# Altium project DC_CDI_Honda_CX500_rev1.3.PrjPcb
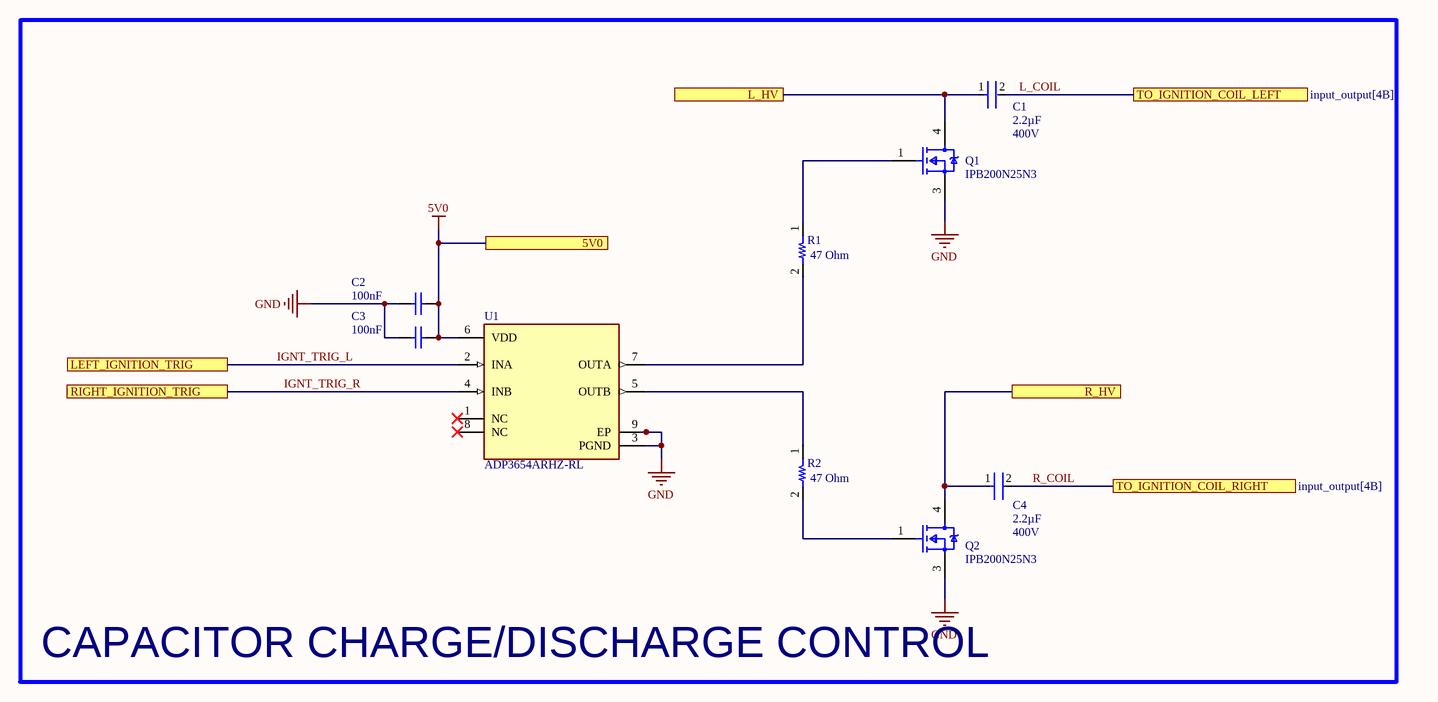
[diagram p0: cd_switching.SchDoc]
6 sheets, 132 parts. Net scope: flat (ports and power ports of the same name join across sheets).
Board file: dc_cdi_cx500.PcbDoc
Sheets:
  cd_switching.SchDoc
  input_output.SchDoc
  input_signal_conditioning.SchDoc
  logic.SchDoc
  HV_power.SchDoc
  LV_power.SchDoc

## Sheet cd_switching.SchDoc: Power Side
size A3; SheetNumber: 1; SheetTotal: 6

### Parts
C1  Voltage Rating (AC): 400V  Capacitance: 2.2µF  [FP-BFC233820225-MFG]  (hidden comment: BFC233820225)
C2  value 100nF  [CAPC1608X90X35LL15T15]  (hidden comment: 06035C104KAT4A)
C3  value 100nF  [CAPC1608X87X35NL15T15]  (hidden comment: C0603C475K8PACTU)
C4  Voltage Rating (AC): 400V  Capacitance: 2.2µF  [FP-BFC233820225-MFG]  (hidden comment: BFC233820225)
Q1  IPB200N25N3  [FP-PG-TO252-3-MFG]
Q2  IPB200N25N3  [FP-PG-TO252-3-MFG]
R1  value 47 Ohm  [0603_FP]  (hidden comment: Resistor_0603)
R2  value 47 Ohm  [0603_FP]  (hidden comment: Resistor_0603)
U1  ADP3654ARHZ-RL  [FP-RH-8-1-IPC_C]

### Blocks framed on the sheet
CAPACITOR CHARGE/DISCHARGE CONTROL: C1-C4 Q1 Q2 R1 R2 U1

### Ports
5V0 (see LV_power[3B]), L_HV (see HV_power[4A]), LEFT_IGNITION_TRIG (see logic[1A]), R_HV (see HV_power[4B]), RIGHT_IGNITION_TRIG (see logic[1B]), TO_IGNITION_COIL_LEFT (see input_output[4B]), TO_IGNITION_COIL_RIGHT (see input_output[4B])

### Nets
5V0: C2.1 C3.2 U1.6(VDD) ; port 5V0
GND: C2.2 C3.1 Q1.3(SOURCE) Q2.3(SOURCE) U1.3(PGND) U1.9(EP)
IGNT_TRIG_L: U1.2(INA) ; port LEFT_IGNITION_TRIG
IGNT_TRIG_R: U1.4(INB) ; port RIGHT_IGNITION_TRIG
L_COIL: C1.2 ; port TO_IGNITION_COIL_LEFT
L_HV: C1.1 Q1.4(DRAIN) ; port L_HV
R_COIL: C4.2 ; port TO_IGNITION_COIL_RIGHT
R_HV: C4.1 Q2.4(DRAIN) ; port R_HV
NetQ1_1: Q1.1(GATE) R1.1
NetQ2_1: Q2.1(GATE) R2.2
NetR1_2: R1.2 U1.7(OUTA)
NetR2_1: R2.1 U1.5(OUTB)

Not connected (* = marked no-connect by the designer): U1 1(NC)* 8(NC)*

### Library data of the parts
C1 C4 = CMP-00030-39758189-1: BFC233820225 Film Capacitor, Polypropylene, 800V, 20% +Tol, 20% -Tol, 0.22uF, Through Hole Mount; Insulation Resistance: 11GΩ; Lead Diameter: 800µm; Voltage Rating (DC): 630V; Dielectric: PP; Packaging: Bulk; Lead Pitch: 27.5mm; Number of Pins: 2; Contact Plating: Tin; Height - Seated (Max): 24.9936mm; Width: 15.0114mm; Min Operating Temperature: -55°C; Lead Free: Lead Free; Length: 31.5mm; Schedule B: 8532250020, 8532250020; Depth: 15mm; NexarPartId: 39758189; Max Operating Temperature: 110°C; Tolerance: 20%; Dielectric Material: PP; RoHS: Compliant; Height: 28mm; Case/Package: Radial; Diameter: 18mm; Termination: Radial; Voltage Rating: 630V; REACH SVHC: Unknown; Radiation Hardening: No; Mount: Through Hole
C2 = CMP-2006-04390-1: Manufacturer: AVX Interconnect / Elco; Part Number: 06035C104KAT4A
C3 = CMP-2006-03238-1: Manufacturer: Kemet; Part Number: C0603C475K8PACTU
Q1 Q2 = CMP-32901-000143-1: MOSFET N-CH 30V 161A DPAK; Manufacturer Part Number: IRLR7843TRPBF; Manufacturer: Infineon; Drain To Source Resistance: 3.2mΩ; Depletion Mode: False; Reverse Recovery Time: 39ns; Reverse Recovery Charge: 36nC; Threshold Vgs Max: 2.3V; Rthja Max: 50°C/W; Threshold Vgs Min: 1.4V; Power Dissipation: 140W; Pulse Drain Current: 620A; Input Capacitace At Vds: 4380pF @ 15V; Turn On Delay Time: 25ns; Gate To Source Voltage: 20V; Max Forward Diode Voltage: 1V; Gate Charge At Vgs: 34nC @ 4.5V; Max Junction Temp: +175°C; Number Of Channels: 1; Turn Off Delay Time: 34ns; ComponentLink2URL: https://www.infineon.com/dgdl/irlr7843pbf.pdf?fileId=5546d462533600a40153566de53526d8; Temperature Range High: +175°C; Octopart: https://octopart.com/irlr7843trpbf-infineon-65875062; Temperature: -55°C to +175°C; Device Class L3: MOSFETs; Category: Trans; Package: PG-TO252-3; Footprint Url: https://www.infineon.com/cms/en/product/packages/PG-TO252/PG-TO252-3-901/; Continuous Drain Current: 161A; Digikey Description: MOSFET N-CH 30V 161A DPAK; Automotive: No; Lead Free: Yes; Drain To Source Breakdown Voltage: 30V; Height: 2.52mm; Temperature Range Low: -55°C; RoHS: TRUE; Number Of N Channels: 1; Drain To Source Voltage: 30V; ComponentLink2Description: Datasheet; Device Class L2: Transistors; Device Class L1: Discrete Semiconductors
R1 R2 = Resistor_0603: Format: 0402; Package: 0402
U1 = CMP-09133-000023-1: IC GATE DRVR LOW-SIDE 8MINISOIC; Number of Outputs: 2; Min Supply Voltage: 4.5V; Output Current: 4A; Max Supply Current: 3mA; Rise Time: 14ns; Fall Time: 25ns; Max Supply Voltage: 18V; Turn-On Delay Time: 35ns; Channel Type: Independent; Package Quantity: 3000; RoHS Compliant: Yes; Series: -; Max Operating Temperature: 125°C; Mount: Surface Mount; Max Output Current: 4A; Lead Free: Contains Lead; Supply Current: 3mA; Packaging: Tape and Reel; Case/Package: MSOP; Min Operating Temperature: -40°C; Min Input Voltage: 4.5V; Max Input Voltage: 18V; Number of Drivers: 2; Nominal Supply Current: 3mA; Number of Pins: 8; Propagation Delay: 35ns

## Sheet input_output.SchDoc
size A4; SheetNumber: 2; SheetTotal: 6
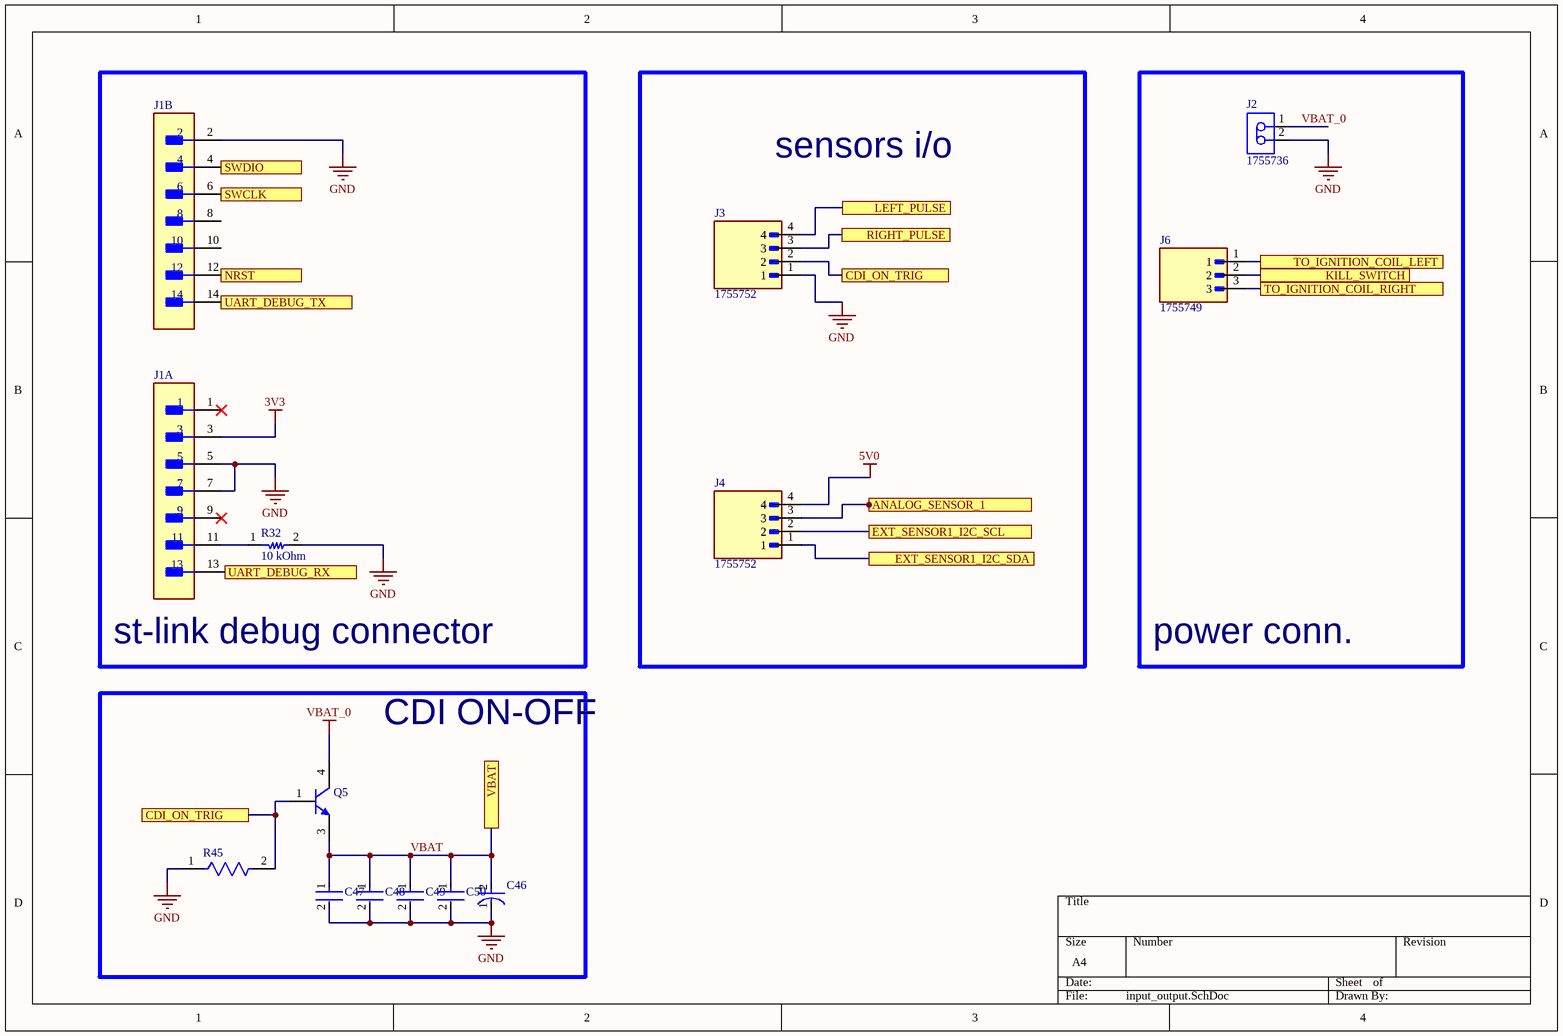
[diagram p1: input_output.SchDoc]

### Parts
C46  EEEFT1E471AP  [FP-FTF-MFG]  (value not drawn)
C47  C1206X104J3GACTU  [FP-C1206X104J3GACTU-MFG]  (value not drawn)
C48  C1206X104J3GACTU  [FP-C1206X104J3GACTU-MFG]  (value not drawn)
C49  C1206X104J3GACTU  [FP-C1206X104J3GACTU-MFG]  (value not drawn)
C50  C1206X104J3GACTU  [FP-C1206X104J3GACTU-MFG]  (value not drawn)
J1  FTSH-107-01-F-DV-K  [FP-FTSH-107-01-F-DV-K-MFG]  (value not drawn)  (parts A,B of 2)
J2  1755736  [PHOE-1755736-2_V]
J3  1755752  [PHOENIX_1755752]
J4  1755752  [PHOENIX_1755752]
J6  1755749  [PHOENIX_1755749]
Q5  MJD3055T4G  [ONSC-DPAK-3-369C-01_V]  (value not drawn)
R32  value 10 kOhm  [0603_FP]  (hidden comment: Resistor_0603)
R45  CRGP0805F10K  [FP-CRGP0805-IPC_C]  (value not drawn)

### Blocks framed on the sheet
st-link debug connector: J1 R32
sensors i/o: J3 J4
power conn.: J2 J6
CDI ON-OFF: C46-C50 Q5 R45

### Ports
ANALOG_SENSOR_1 (see logic[1A]), CDI_ON_TRIG (see input_output[1D]), CDI_ON_TRIG (see input_output[3B]), EXT_SENSOR1_I2C_SCL (see logic[3A]), EXT_SENSOR1_I2C_SDA (see logic[3A]), KILL_SWITCH (see logic[3B]), LEFT_PULSE (see input_signal_conditioning[1B]), NRST (see logic[3B]), RIGHT_PULSE (see input_signal_conditioning[1C]), SWCLK (see logic[1B]), SWDIO (see logic[1B]), TO_IGNITION_COIL_LEFT (see cd_switching[6B]), TO_IGNITION_COIL_RIGHT (see cd_switching[6C]), UART_DEBUG_RX (see logic[1B]), UART_DEBUG_TX (see logic[1B]), VBAT (see HV_power[1C], LV_power[1B])

### Nets
3V3: J1.3
5V0: J4.4
GND: C46.1(C) C47.2 C48.2 C49.2 C50.2 J1.2 J1.5 J1.7 J2.2 J3.1 R32.2 R45.1
VBAT_0: J2.1 Q5.4(C)
EXT_SENSOR1_I2C_SCL: J4.2 ; port EXT_SENSOR1_I2C_SCL
EXT_SENSOR1_I2C_SDA: J4.1 ; port EXT_SENSOR1_I2C_SDA
L_COIL: J6.1 ; port TO_IGNITION_COIL_LEFT
R_COIL: J6.3 ; port TO_IGNITION_COIL_RIGHT
SWCLK: J1.6 ; port SWCLK
SWDIO: J1.4 ; port SWDIO
UART_DEBUG_RX: J1.13 ; port UART_DEBUG_RX
UART_DEBUG_TX: J1.14 ; port UART_DEBUG_TX
VBAT: C46.2(A) C47.1 C48.1 C49.1 C50.1 Q5.3(E) ; port VBAT
NetD1_1: J3.4 ; port LEFT_PULSE
NetD2_1: J3.3 ; port RIGHT_PULSE
NetJ1_11: J1.11 R32.1
NetJ1_12: J1.12 ; port NRST
NetJ3_2: J3.2 Q5.1(B) R45.2 ; port CDI_ON_TRIG
NetJ4_3: J4.3 ; port ANALOG_SENSOR_1
NetJ6_2: J6.2 ; port KILL_SWITCH

Not connected (* = marked no-connect by the designer): J1 1* 8 9* 10

### Notes on the sheet
- (in symbol CMP-05427-000040-1) +

### Library data of the parts
C46 = CMP-05427-000040-1: CAP ALUM 470UF 20% 25V SMD; ESR (Equivalent Series Resistance): 80mR; Dielectric Material: Aluminium; Lead Diameter: 0.9mm; Ripple Current: 850mA; Leakage Current: 117.5uA; Life (Hours): 2000Hour; Lead Free: Lead Free; Height - Seated (Max): 0.413inch; Contact Plating: Tin; Voltage: 25V; Package Quantity: 500; REACH SVHC: No SVHC; Diameter: 8mm; Features: General Purpose; Voltage Rating: 25V; Radiation Hardening: No; Number of Pins: 2; Length: 10.2mm; Max Operating Temperature: 105°C; Tolerance: 20%; Lead Pitch: 3.1mm; Voltage Rating (DC): 25V; Packaging: Tape and Reel; RoHS Compliant: Yes; Series: FT; Height: 10.2mm; Capacitance: 470uF; Construction: Cylindrical; Case/Package: Radial; Mount: Surface Mount; Termination: SMD/SMT; Min Operating Temperature: -55°C; Ripple Current (AC): 850mA
C47-C50 = CMP-03020-034648-1: CAP CER 0.1UF 25V C0G/NP0 1206; RoHS Compliant: Yes
J1 = CMP-02766-001448-1: CONN HEADER SMD 14POS 1.27MM; Gender: Male; Connector Type: Male Pin; Number of Contacts: 14; Row Spacing: 0.05inch; Min Operating Temperature: -55°C; Package Quantity: 1; Lead Free: Lead Free; RoHS Compliant: Yes; Contact Material: Bronze; Contact Plating: Gold; Number of Rows: 2; Housing Material: Polymer; Contact Type: Male Pin; Series: FTSH; Max Operating Temperature: 125°C; Orientation: Straight; Number of Positions: 14; Pitch: 1.27mm; Housing Color: Black; Color: Black; Radiation Hardening: No; Length: 8.89mm; Termination: Solder; Packaging: Rail/Tube; Depth: 5.84mm; Mount: Surface Mount; Contact Mating Length: 0.12inch
J2 = CMP-2000-05300-1: Male Header, Pitch 5.08 mm, 1 x 2 Postion, Height 12 mm, Tail Length 3.9 mm, RoHS, Bulk; Manufacturer: Phoenix Contact; Content: 250pc(s); Pitch: 5.08mm; Industrial packaging: Yes; Number of contacts: 2; Manufacturer URL: http://www.phoenixcontact.com/; Datasheet Version: Apr-16; Datasheet URL: http://www.mouser.com/ds/2/324/ItemDetail_1755736-921028.pdf; Manufacturer part No.: 1755736; Type: MSTBVA2,5/2-G-5,08; Colour: Green
Q5 = CMP-1048-00146-1: Complementary Power Transistor, 3-Pin DPAK, Pb-Free, Tape and Reel; Manufacturer: On Semiconductor; Polarity: NPN; fT Min (MHz): 2; IC Continuous (A): 10; PackageVersion: Rev. E, 02/2014; ComponentLink3URL: http://www.onsemi.cn/pub_link/Collateral/369C.PDF; ComponentLink1Description: Manufacturer URL; PackageReference: DPAK-3-369C-01; ComponentLink1URL: http://www.onsemi.com/; ComponentLink3Description: Package Specification; ComponentLink2URL: http://www.onsemi.cn/pub_link/Collateral/MJD2955-D.PDF; ComponentLink2Description: Datasheet; DatasheetVersion: Rev. 13; Packing: Tape and Reel; PackageDescription: 3-Pin Flange Mount, Body 6.54 x 6.095 mm, Pitch 2.29 mm; Mounting Technology: Surface Mount; PartNumber: MJD3055T4G; RoHS: TRUE
R32 = Resistor_0603: Format: 0402; Package: 0402
R45 = CMP-03211-006861-1: CRGP 0805 10K 1%; Manufacturer: TE; Power Rating: 0.33W; Voltage Rating: 150V; Value: 10KΩ; Tolerance: 0.01; Temperature Coefficient: ±100ppm/°C; Manufacturer Part Number: CRGP0805F10K; ComponentLink2URL: https://www.mouser.com/datasheet/2/418/NG_DS_9-1773463-9_A-1358566.pdf; Temperature Range Low: -55°C; Ipc Land Pattern Name: RESC200125X55; Device Class L2: Resistors; Automotive: No; Device Class L3: Chip SMD Resistors; Composition: Thick Film; Temperature Range High: +155°C; Temperature: -55°C to +155°C; Height: 0.65mm; Series: CRGP; RoHS: TRUE; Device Class L1: Passive Components; Octopart: https://octopart.com/crgp0805f10k-te+connectivity-91018782; Package: CRGP0805; Digikey Description: CRGP 0805 10K 1%; Ambient Temperature Range High: +70°C; Lead Free: Yes; ComponentLink2Description: Datasheet; Category: Res; Resistance: 10KΩ
J3 J4 = 1755752: Package: None; Price: None; Value: *; MP: 1755752; Availability: Unavailable
J6 = 1755749: Package: None; Price: None; Value: *; MP: 1755749; Availability: Unavailable

## Sheet input_signal_conditioning.SchDoc
size A4; SheetNumber: 3; SheetTotal: 6
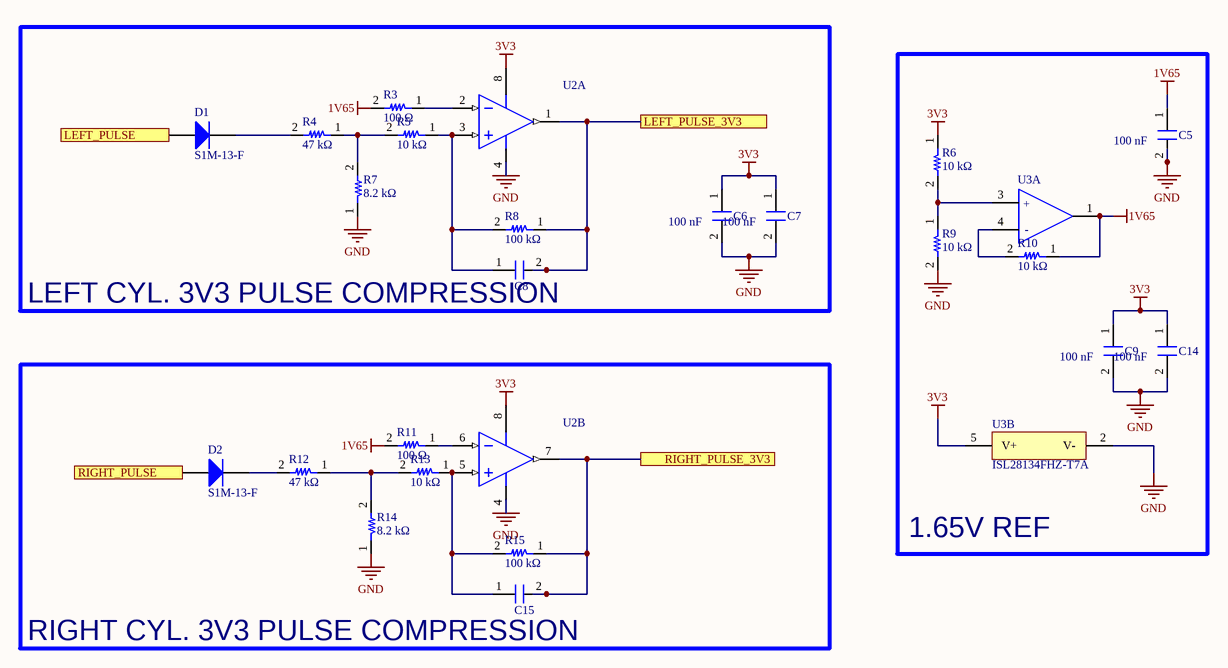
[diagram p2: input_signal_conditioning.SchDoc]

### Parts
C5  value 100 nF  [0402_fp]  (hidden comment: Capacitor_0402)
C6  value 100 nF  [0402_fp]  (hidden comment: Capacitor_0402)
C7  value 100 nF  [0402_fp]  (hidden comment: Capacitor_0402)
C8  Capacitor_0402  [0402_fp]  (value not drawn)
C9  value 100 nF  [0402_fp]  (hidden comment: Capacitor_0402)
C14  value 100 nF  [0402_fp]  (hidden comment: Capacitor_0402)
C15  Capacitor_0402  [0402_fp]  (value not drawn)
D1  S1M-13-F  [DIOD-S1M-13-F-SMA-2_V]
D2  S1M-13-F  [DIOD-S1M-13-F-SMA-2_V]
R3  value 100 Ω  [0402_fp]  (hidden comment: Resistor_0402)
R4  value 47 kΩ  [0402_fp]  (hidden comment: Resistor_0402)
R5  value 10 kΩ  [0402_fp]  (hidden comment: Resistor_0402)
R6  value 10 kΩ  [0402_fp]  (hidden comment: Resistor_0402)
R7  value 8.2 kΩ  [0402_fp]  (hidden comment: Resistor_0402)
R8  value 100 kΩ  [0402_fp]  (hidden comment: Resistor_0402)
R9  value 10 kΩ  [0402_fp]  (hidden comment: Resistor_0402)
R10  value 10 kΩ  [0402_fp]  (hidden comment: Resistor_0402)
R11  value 100 Ω  [0402_fp]  (hidden comment: Resistor_0402)
R12  value 47 kΩ  [0402_fp]  (hidden comment: Resistor_0402)
R13  value 10 kΩ  [0402_fp]  (hidden comment: Resistor_0402)
R14  value 8.2 kΩ  [0402_fp]  (hidden comment: Resistor_0402)
R15  value 100 kΩ  [0402_fp]  (hidden comment: Resistor_0402)
U2  LM358MX  [D0008A_M]  (value not drawn)  (parts A,B of 2)
U3  ISL28134FHZ-T7A  [P5_064A_MFG]  (value not drawn)  (parts A,B of 2)

### Blocks framed on the sheet
LEFT CYL. 3V3 PULSE COMPRESSION: C6-C8 D1 R3-R5 R7 R8 U2
1.65V REF: C5 C9 C14 R6 R9 R10 U3
RIGHT CYL. 3V3 PULSE COMPRESSION: C15 D2 R11-R15 U2

### Ports
LEFT_PULSE (see input_output[3A]), LEFT_PULSE_3V3 (see logic[1D], logic[3A]), RIGHT_PULSE (see input_output[3A]), RIGHT_PULSE_3V3 (see logic[1D], logic[3A])

### Nets
1V65: C5.1 R3.2 R10.1 R11.2 U3.1(OUT)
3V3: C6.1 C7.1 C9.1 C14.1 R6.1 U2.8(V+) U3.5(V+)
GND: C5.2 C6.2 C7.2 C9.2 C14.2 R7.1 R9.2 R14.1 U2.4(GND) U3.2(V-)
NetC8_1: C8.1 R5.1 R8.2 U2.3(INA+)
NetC8_2: C8.2 R8.1 U2.1(OUTA) ; port LEFT_PULSE_3V3
NetC15_1: C15.1 R13.1 R15.2 U2.5(INB+)
NetC15_2: C15.2 R15.1 U2.7(OUTB) ; port RIGHT_PULSE_3V3
NetD1_1: D1.1(A) ; port LEFT_PULSE
NetD1_2: D1.2(K) R4.2
NetD2_1: D2.1(A) ; port RIGHT_PULSE
NetD2_2: D2.2(K) R12.2
NetR3_1: R3.1 U2.2(INA-)
NetR4_1: R4.1 R5.2 R7.2
NetR6_2: R6.2 R9.1 U3.3(IN+)
NetR10_2: R10.2 U3.4(IN-)
NetR11_1: R11.1 U2.6(INB-)
NetR12_1: R12.1 R13.2 R14.2

### Notes on the sheet
- (in symbol CMP-00572-88252605-3, part A) +; -

### Library data of the parts
C5-C7 C9 C14 = Capacitor_0402: Format: 0402; Package: 0402
C8 C15 = Capacitor_0402: Value: 3.3 nF; Format: 0402; Package: 0402
D1 D2 = CMP-0639-00001-1: Surface Mount Glass Passivated Rectifier, 1000V, 1 A, -65 to 125 degC, 2-Pin SMA Package, RoHS, Tape and Reel; Manufacturer: Diodes Inc; Maximum Reverse Current IR (uA): 5; Maximum Peak Forward Surge Current IFSM (A): 30; Maximum Average Rectified Current IO (A): 1; Peak Repetitive Reverse Voltage VRRM (V): 1000; Total Capacitance CT (pF): 10; Forward Voltage Drop VF (V): 1.1; ComponentLink1URL: http://www.diodes.com/; Operating Temperature Range: -65 to 150 degC; ComponentLink3URL: http://diodes.com/datasheets/ds16003.pdf; ComponentLink3Description: Package Specification; PackageDescription: 2-Pin SMD, Body 4.3 x 2.605 mm, Height 2.3 mm; Mounting Technology: Surface Mount; ComponentLink1Description: Manufacturer URL; PackageReference: S1M-13-F-SMA-2; ComponentLink2URL: http://diodes.com/datasheets/ds16003.pdf; ComponentLink2Description: Datasheet; RoHS: TRUE; DatasheetVersion: Rev. 22 - 2; Packing: Tape and Reel; PackageVersion: Rev. 22 - 2; PartNumber: S1M-13-F
U2 = CMP-0055-00630-3: Low Power Dual Operational Amplifier, 8-pin Narrow SOIC; Manufacturer: Texas Instruments; PowerWise: N; PackageTopMarking: NSZXTT*LM*358M; CompType: Amplifiers; ComponentLink1URL: http://www.ti.com/general/docs/lit/getliterature.tsp?genericPartNumber=LM358-N&fileType=pdf; PinCount: 8; PackageDescription: SOIC Narrow, 4.9 x 3.9 x 1.45mm, 8 Lead, 1.27mm Pitch; Code_IPC: SOIC127P600-8; RoHS: N; Code_JEDEC: MS-012-AA; Package Reference: D0008A; ComponentLink1Description: Datasheet URL
U3 = CMP-00572-88252605-3: 5V Ultra Low Noise, Zero Drift Rail-to-Rail Precision Op Amp; Manufacturer Lifecycle Status: ACTIVE; Slew Rate: 1.5V/µs; Min Dual Supply Voltage: 1.125V; Bandwidth: 3.5MHz; Operating Supply Current: 675µA; Output Current per Channel: 65mA; Power Supply Rejection Ratio (PSRR): 135dB; Input Offset Voltage (Vos): -200nV; RAM Size: 384kB; Voltage Gain: 174dB; Number of Channels: 1; Pitch: 1mm; Max Supply Voltage: 6V; Input Bias Current: 120pA; Min Supply Voltage: 2.25V; Max Dual Supply Voltage: 3V; Supply Type: Dual, Single; Radiation Hardening: No; Min Operating Temperature: -40°C; ComponentLink1URL: http://www.renesas.com; ComponentLink3URL: https://www.renesas.com/en/document/psc/package-drawing-sot23-5pin-p5064a; Number of Pins: 5; Length: 2.9mm; Contact Plating: Tin; ComponentLink2URL: https://octopart.com/cad-content/api/get-model-datasheet/15189/88252605; Export Control Classification Number (ECCN) Code: EAR99; ComponentLink1Description: Manufacturer's Website; Gain Bandwidth Product: 3.5MHz; HelpURL: https://octopart.com/cad-content/api/get-model-datasheet/15189/88252605; ComponentLink3Description: Manufacturer's Package Drawing; RoHS: Compliant; Case/Package: SOT-23; Common Mode Rejection Ratio: 135dB; Lead Free: Lead Free; Output Current: 65mA; Width: 1.6mm; Nominal Supply Current: 675µA; Lifecycle Status: Production; Mount: Surface Mount; ComponentLink2Description: Datasheet URL; Max Operating Temperature: 125°C; Height: 0m; Number of Circuits: 1
R3-R15 = Resistor_0402: Package: 0402

## Sheet logic.SchDoc
size A4; SheetNumber: 4; SheetTotal: 6
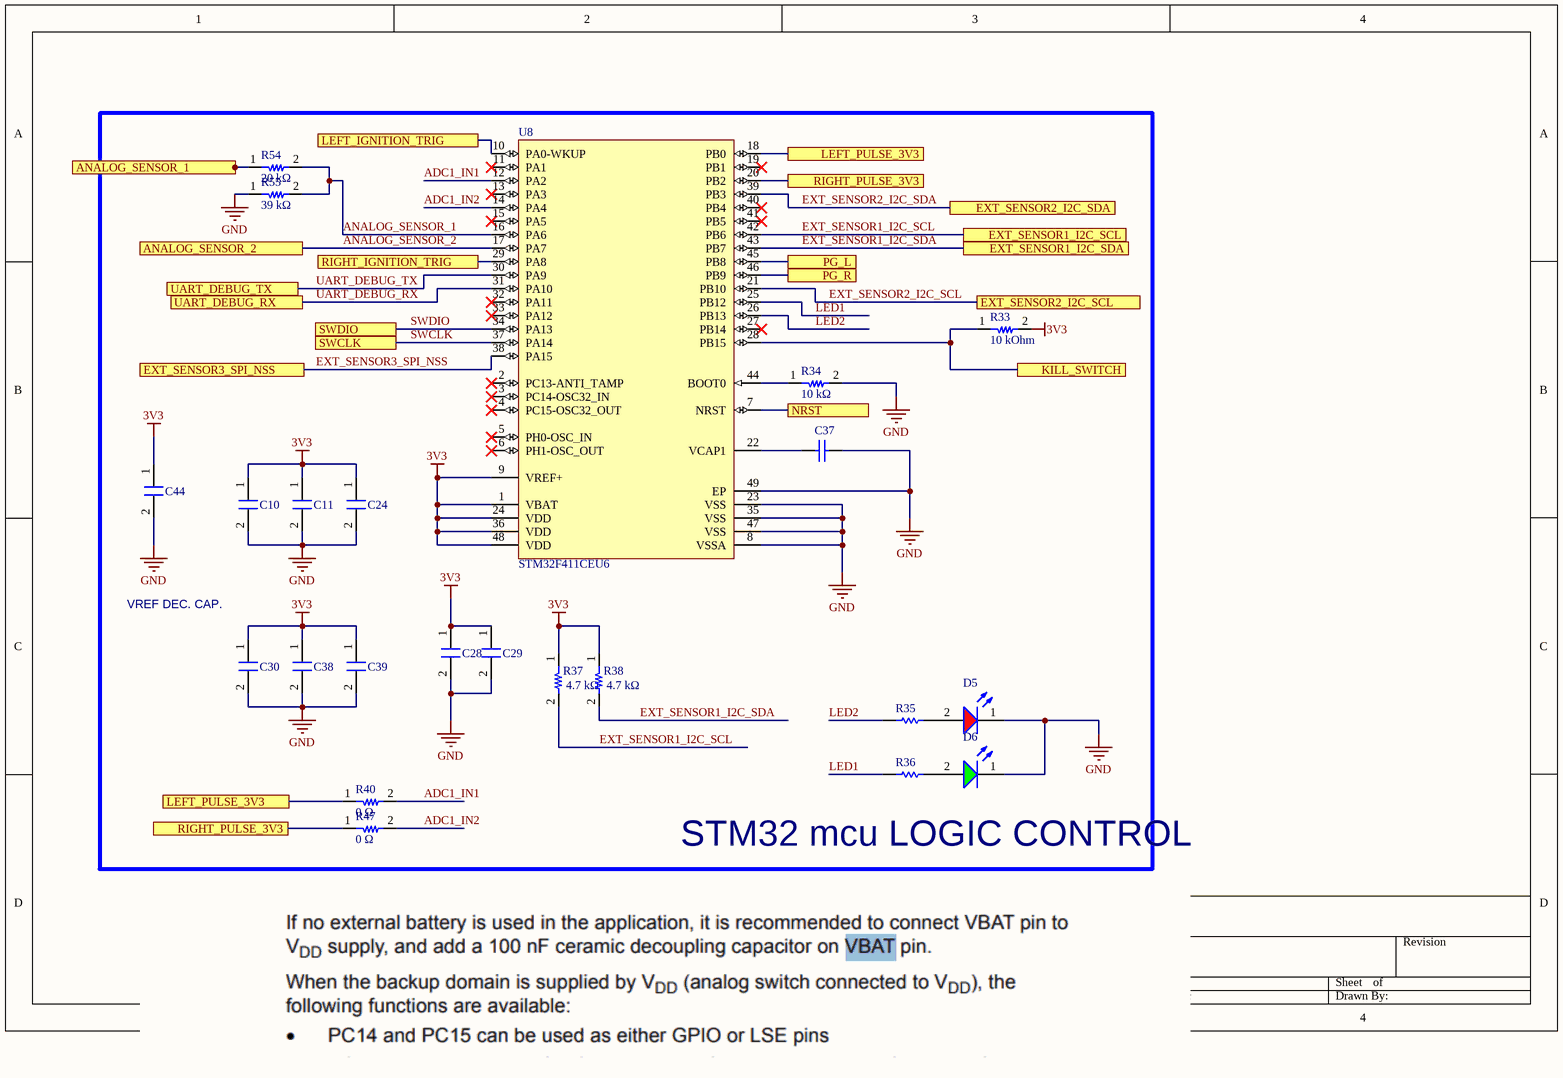
[diagram p3: logic.SchDoc]

### Parts
C10  Capacitor_0402  [0402_fp]  (value not drawn)
C11  Capacitor_0402  [0402_fp]  (value not drawn)
C24  Capacitor_0402  [0402_fp]  (value not drawn)
C28  Capacitor_0402  [0402_fp]  (value not drawn)
C29  Capacitor_0402  [0402_fp]  (value not drawn)
C30  Capacitor_0402  [0402_fp]  (value not drawn)
C37  0603ZD475MAT2A  [CAPC1608X90X35NL15T15]  (value not drawn)
C38  Capacitor_0402  [0402_fp]  (value not drawn)
C39  Capacitor_0402  [0402_fp]  (value not drawn)
C44  Capacitor_0402  [0402_fp]  (value not drawn)
D5  150080RS75000  [WL-SMCW_0805_150080xx75000]  (value not drawn)
D6  150080GS75000  [WL-SMCW_0805_150080xx75000]  (value not drawn)
R33  value 10 kOhm  [0603_FP]  (hidden comment: Resistor_0603)
R34  value 10 kΩ  [0402_fp]  (hidden comment: Resistor_0402)
R35  MCS04020D5600BE100  [RESC1005X37X20NL05T10]  (value not drawn)
R36  MCS04020D5600BE100  [RESC1005X37X20NL05T10]  (value not drawn)
R37  value 4.7 kΩ  [0402_fp]  (hidden comment: Resistor_0402)
R38  value 4.7 kΩ  [0402_fp]  (hidden comment: Resistor_0402)
R40  value 0 Ω  [0402_fp]  (hidden comment: Resistor_0402)
R47  value 0 Ω  [0402_fp]  (hidden comment: Resistor_0402)
R54  value 20 kΩ  [0402_fp]  (hidden comment: Resistor_0402)
R55  value 39 kΩ  [0402_fp]  (hidden comment: Resistor_0402)
U8  STM32F411CEU6  [STM-UFQFPN48_L]

### Ports
ANALOG_SENSOR_1 (see input_output[3B]), ANALOG_SENSOR_2, EXT_SENSOR1_I2C_SCL (see input_output[3C]), EXT_SENSOR1_I2C_SDA (see input_output[3C]), EXT_SENSOR2_I2C_SCL, EXT_SENSOR2_I2C_SDA, EXT_SENSOR3_SPI_NSS, KILL_SWITCH (see input_output[4B]), LEFT_IGNITION_TRIG (see cd_switching[2B]), LEFT_PULSE_3V3 (see input_signal_conditioning[3B], logic[1D]), LEFT_PULSE_3V3 (see input_signal_conditioning[3B], logic[3A]), NRST (see input_output[1B]), PG_L (see HV_power[4B]), PG_R (see HV_power[4C]), RIGHT_IGNITION_TRIG (see cd_switching[2B]), RIGHT_PULSE_3V3 (see input_signal_conditioning[3C], logic[1D]), RIGHT_PULSE_3V3 (see input_signal_conditioning[3C], logic[3A]), SWCLK (see input_output[1A]), SWDIO (see input_output[1A]), UART_DEBUG_RX (see input_output[1C]), UART_DEBUG_TX (see input_output[1B])

### Nets
3V3: C10.1 C11.1 C24.1 C28.1 C29.1 C30.1 C38.1 C39.1 C44.1 R33.2 R37.1 R38.1 U8.1(VBAT) U8.9(VREF+) U8.24(VDD) U8.36(VDD) U8.48(VDD)
GND: C10.2 C11.2 C24.2 C28.2 C29.2 C30.2 C37.2 C38.2 C39.2 C44.2 D5.1(K) D6.1(K) R34.2 R55.1 U8.8(VSSA) U8.23(VSS) U8.35(VSS) U8.47(VSS) U8.49(EP)
ADC1_IN1: R40.2 U8.12(PA2)
ADC1_IN2: R47.2 U8.14(PA4)
ANALOG_SENSOR_1: R54.2 R55.2 U8.16(PA6)
ANALOG_SENSOR_2: U8.17(PA7) ; port ANALOG_SENSOR_2
EXT_SENSOR1_I2C_SCL: R37.2 U8.42(PB6) ; port EXT_SENSOR1_I2C_SCL
EXT_SENSOR1_I2C_SDA: R38.2 U8.43(PB7) ; port EXT_SENSOR1_I2C_SDA
EXT_SENSOR2_I2C_SCL: U8.21(PB10) ; port EXT_SENSOR2_I2C_SCL
EXT_SENSOR2_I2C_SDA: U8.39(PB3) ; port EXT_SENSOR2_I2C_SDA
EXT_SENSOR3_SPI_NSS: U8.38(PA15) ; port EXT_SENSOR3_SPI_NSS
IGNT_TRIG_L: U8.10(PA0-WKUP) ; port LEFT_IGNITION_TRIG
IGNT_TRIG_R: U8.29(PA8) ; port RIGHT_IGNITION_TRIG
LED1: R36.1 U8.25(PB12)
LED2: R35.1 U8.26(PB13)
SWCLK: U8.37(PA14) ; port SWCLK
SWDIO: U8.34(PA13) ; port SWDIO
UART_DEBUG_RX: U8.31(PA10) ; port UART_DEBUG_RX
UART_DEBUG_TX: U8.30(PA9) ; port UART_DEBUG_TX
NetC8_2: R40.1 U8.18(PB0) ; port LEFT_PULSE_3V3
NetC15_2: R47.1 U8.20(PB2) ; port RIGHT_PULSE_3V3
NetC37_1: C37.1 U8.22(VCAP1)
NetD5_2: D5.2(A) R35.2
NetD6_2: D6.2(A) R36.2
NetJ1_12: U8.7(NRST) ; port NRST
NetJ4_3: R54.1 ; port ANALOG_SENSOR_1
NetJ6_2: R33.1 U8.28(PB15) ; port KILL_SWITCH
NetR24_1: U8.45(PB8) ; port PG_L
NetR34_1: R34.1 U8.44(BOOT0)
NetR46_1: U8.46(PB9) ; port PG_R

Not connected (* = marked no-connect by the designer): U8 2(PC13-ANTI_TAMP)* 3(PC14-OSC32_IN)* 4(PC15-OSC32_OUT)* 5(PH0-OSC_IN)* 6(PH1-OSC_OUT)* 11(PA1)* 13(PA3)* 15(PA5)* 19(PB1)* 27(PB14)* 32(PA11)* 33(PA12)* 40(PB4)* 41(PB5)*

### Notes on the sheet
- VREF DEC. CAP.
- STM32 mcu LOGIC CONTROL

### Library data of the parts
C10 C11 C24 C28-C30 C38 C39 = Capacitor_0402: Value: 10 nF; Format: 0402; Package: 0402
C37 = CMP-1035-02787-2: Manufacturer: AVX Interconnect / Elco; Part Number: 0603ZD475MAT2A
C44 = Capacitor_0402: Value: 100 nF; Format: 0402; Package: 0402
D5 = CMP-1426-00011-3: LED Uni-Color Red 630nm 2-Pin Chip 0805(2012Metric) T/R; Viewing Angle: 140°; Max Junction Temperature (Tj): 95°C; Power Dissipation: 72mW; Forward Current: 100mA; Forward Voltage: 2V; Wavelength: 625nm; Test Current: 20mA; Max Reverse Voltage (DC): 5V; Luminous Intensity: 150mcd; Lens Style: Clear, Rectangular; REACH SVHC: Unknown; Height: 700µm; Case Code (Metric): 2012; Peak Wavelength: 630nm; Length: 2mm; Width: 1.25mm; RoHS: Compliant; Packaging: Tape and Reel; Dominant Wavelength: 625nm; Color: Red; Case Code (Imperial): 0805; Min Operating Temperature: -40°C; Mount: Surface Mount; Max Operating Temperature: 85°C; Case/Package: 0805
D6 = CMP-1426-00007-3: WURTH ELEKTRONIK - 150080GS75000 - LED, Green, SMD, 0805, 30 mA, 3.2 V, 520 nm; Forward Voltage: 3.2V; Viewing Angle: 140°; Power Dissipation: 105mW; Peak Wavelength: 515nm; Max Reverse Voltage (DC): 5V; Luminous Intensity: 450mcd; Wavelength: 525nm; Max Junction Temperature (Tj): 95°C; Forward Current: 100mA; Test Current: 20mA; Lens Style: Clear, Rectangular; Length: 2mm; Case/Package: 0805; Case Code (Metric): 2012; Color: Green; Height: 700µm; Width: 1.25mm; Packaging: Tape and Reel; Mount: Surface Mount; REACH SVHC: Unknown; RoHS: Compliant; Min Operating Temperature: -40°C; Reverse Voltage: 5V; Max Operating Temperature: 85°C; Dominant Wavelength: 525nm; Case Code (Imperial): 0805
R33 = Resistor_0603: Format: 0402; Package: 0402
R35 R36 = CMP-2002-02518-1: Manufacturer: Vishay BCcomponents; Part Number: MCS04020D5600BE100
U8 = CMP-0243-00165-1: ARM Cortex-M4 32-bit MCU+FPU, 512 KB Flash, 128 KB RAM, 36 I/Os, 48-Pin UFQFPN, -40 to 85 degC, Tray; Operating Frequency(F) (Processor speed) (MHz): 100; FLASH Size (Prog) (kB): 512; Internal RAM Size (kB): 128; I/Os (High Current): 36; Supply Voltage(Vcc) min (V): 1.7; Package Reference: 48-Pin Ultra Thin Fine Pitch Quad Flat No-Lead, 7 x 7 x 0.6 mm Body, 0.5 mm Pitch, Exposed Pad; ComponentLink1Description: Manufacturer URL; ComponentLink1URL: http://www.st.com/; Packing: Tray; Package Description: UFQFPN48; Core: ARM Cortex-M4; ComponentLink2Description: Datasheet; ComponentLink2URL: http://www.st.com/st-web-ui/static/active/en/resource/technical/document/datasheet/DM00115249.pdf; DatasheetVersion: Rev. 6; Mounting Technology: Surface Mount
R34 R37 R38 R40 R47 R54 R55 = Resistor_0402: Package: 0402

## Sheet HV_power.SchDoc
size A4; SheetNumber: 5; SheetTotal: 6
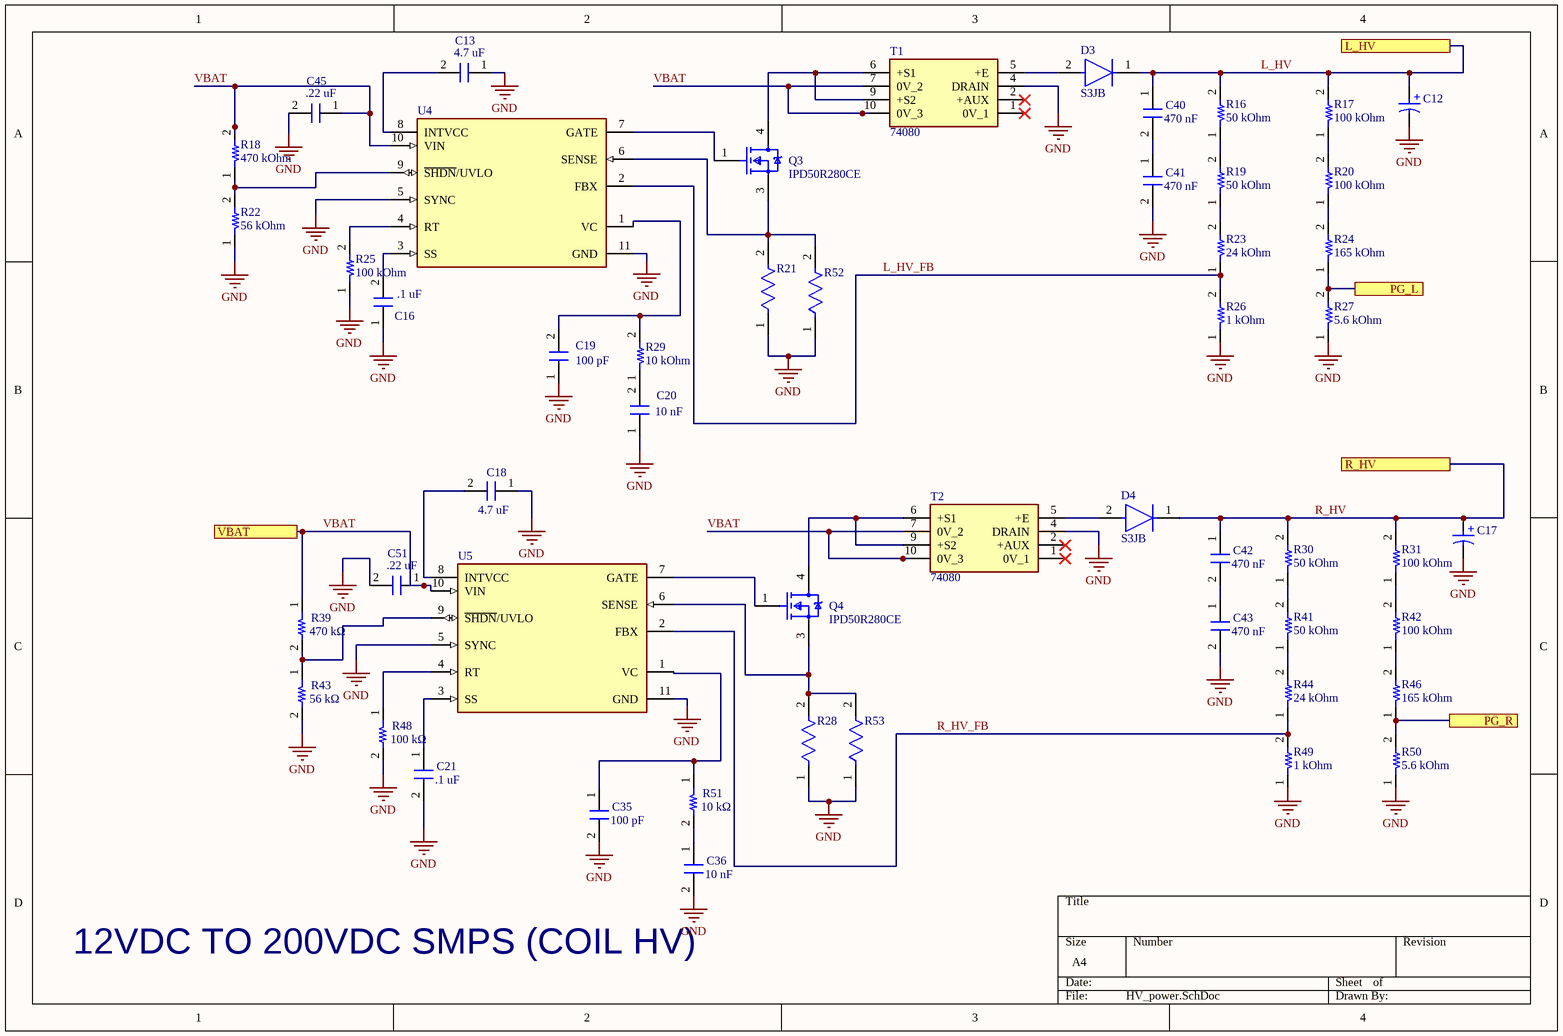
[diagram p4: HV_power.SchDoc]

### Parts
C12  860021373001  [WCAP-ATG5_D6.3H11]  (value not drawn)
C13  value 4.7 uF  [0603_FP]  (hidden comment: GRM21BR61C475KA88L)
C16  value .1 uF  [0603_FP]  (hidden comment: Capacitor_0603)
C17  860021373001  [WCAP-ATG5_D6.3H11]  (value not drawn)
C18  value 4.7 uF  [0603_FP]  (hidden comment: Capacitor_0603)
C19  value 100 pF  [0603_FP]  (hidden comment: Capacitor_0603)
C20  value 10 nF  [0603_FP]  (hidden comment: Capacitor_0603)
C21  value .1 uF  [0603_FP]  (hidden comment: Capacitor_0603)
C35  value 100 pF  [0603_FP]  (hidden comment: Capacitor_0603)
C36  value 10 nF  [0603_FP]  (hidden comment: Capacitor_0603)
C40  value 470 nF  [0603_FP]  (hidden comment: Capacitor_0603)
C41  value 470 nF  [0603_FP]  (hidden comment: Capacitor_0603)
C42  value 470 nF  [0603_FP]  (hidden comment: Capacitor_0603)
C43  value 470 nF  [0603_FP]  (hidden comment: Capacitor_0603)
C45  value .22 uF  [0603_FP]  (hidden comment: GRM21BR61C475KA88L)
C51  value .22 uF  [0603_FP]  (hidden comment: GRM21BR61C475KA88L)
D3  S3JB  [FP-403AF-MFG]
D4  S3JB  [FP-403AF-MFG]
Q3  IPD50R280CE  [FP-PG-TO252-3-MFG]
Q4  IPD50R280CE  [FP-PG-TO252-3-MFG]
R16  value 50 kOhm  [0603_FP]  (hidden comment: Resistor_0603)
R17  value 100 kOhm  [0603_FP]  (hidden comment: Resistor_0603)
R18  value 470 kOhm  [0603_FP]  (hidden comment: Resistor_0603)
R19  value 50 kOhm  [0603_FP]  (hidden comment: Resistor_0603)
R20  value 100 kOhm  [0603_FP]  (hidden comment: Resistor_0603)
R21  CSRN2010FK20L0  [FP-CSRN2010-IPC_B]  (value not drawn)
R22  value 56 kOhm  [0603_FP]  (hidden comment: Resistor_0603)
R23  value 24 kOhm  [0603_FP]  (hidden comment: Resistor_0603)
R24  value 165 kOhm  [0603_FP]  (hidden comment: Resistor_0603)
R25  value 100 kOhm  [0603_FP]  (hidden comment: Resistor_0603)
R26  value 1 kOhm  [0603_FP]  (hidden comment: Resistor_0603)
R27  value 5.6 kOhm  [0603_FP]  (hidden comment: Resistor_0603)
R28  CSRN2010FK20L0  [FP-CSRN2010-IPC_B]  (value not drawn)
R29  value 10 kOhm  [0603_FP]  (hidden comment: Resistor_0603)
R30  value 50 kOhm  [0603_FP]  (hidden comment: Resistor_0603)
R31  value 100 kOhm  [0603_FP]  (hidden comment: Resistor_0603)
R39  value 470 kΩ  [0603_FP]  (hidden comment: Resistor_0603)
R41  value 50 kOhm  [0603_FP]  (hidden comment: Resistor_0603)
R42  value 100 kOhm  [0603_FP]  (hidden comment: Resistor_0603)
R43  value 56 kΩ  [0603_FP]  (hidden comment: Resistor_0603)
R44  value 24 kOhm  [0603_FP]  (hidden comment: Resistor_0603)
R46  value 165 kOhm  [0603_FP]  (hidden comment: Resistor_0603)
R48  value 100 kΩ  [0603_FP]  (hidden comment: Resistor_0603)
R49  value 1 kOhm  [0603_FP]  (hidden comment: Resistor_0603)
R50  value 5.6 kOhm  [0603_FP]  (hidden comment: Resistor_0603)
R51  value 10 kΩ  [0603_FP]  (hidden comment: Resistor_0603)
R52  CSRN2010FK20L0  [FP-CSRN2010-IPC_B]  (value not drawn)
R53  CSRN2010FK20L0  [FP-CSRN2010-IPC_B]  (value not drawn)
T1  74080  [74080]
T2  74080  [74080]
U4  LT3758EDD#PBF  [FP-DD-10-05-08-1699-IPC_B]  (value not drawn)
U5  LT3758EDD#PBF  [FP-DD-10-05-08-1699-IPC_B]  (value not drawn)

### Ports
L_HV (see cd_switching[4B]), PG_L (see logic[3B]), PG_R (see logic[3B]), R_HV (see cd_switching[6B]), VBAT (see input_output[2D], LV_power[1B])

### Nets
GND: C12.2(N) C13.1 C16.1 C17.2(N) C18.1 C19.1 C20.1 C21.2 C35.2 C36.2 C41.2 C43.2 C45.2 C51.2 R21.1 R22.1 R25.1 R26.1 R27.1 R28.1 R43.2 R48.2 R49.1 R50.1 R52.1 R53.1 T1.4(DRAIN) T2.4(DRAIN) U4.5(SYNC) U4.11(GND) U5.5(SYNC) U5.11(GND)
L_HV: C12.1(P) C40.1 D3.1(C) R16.2 R17.2 ; port L_HV
L_HV_FB: R23.1 R26.2 U4.2(FBX)
R_HV: C17.1(P) C42.1 D4.1(C) R30.2 R31.2 ; port R_HV
R_HV_FB: R44.1 R49.2 U5.2(FBX)
VBAT: C45.1 C51.1 R18.2 R39.1 T1.7(0V_2) T1.10(0V_3) T2.7(0V_2) T2.10(0V_3) U4.10(VIN) U5.10(VIN) ; port VBAT
NetC13_2: C13.2 U4.8(INTVCC)
NetC16_2: C16.2 U4.3(SS)
NetC18_2: C18.2 U5.8(INTVCC)
NetC19_2: C19.2 R29.2 U4.1(VC)
NetC20_2: C20.2 R29.1
NetC21_1: C21.1 U5.3(SS)
NetC35_1: C35.1 R51.1 U5.1(VC)
NetC36_1: C36.1 R51.2
NetC40_2: C40.2 C41.1
NetC42_2: C42.2 C43.1
NetD3_2: D3.2(A) T1.5(+E)
NetD4_2: D4.2(A) T2.5(+E)
NetQ3_1: Q3.1(GATE) U4.7(GATE)
NetQ3_3: Q3.3(SOURCE) R21.2 R52.2 U4.6(SENSE)
NetQ3_4: Q3.4(DRAIN) T1.6(+S1) T1.9(+S2)
NetQ4_1: Q4.1(GATE) U5.7(GATE)
NetQ4_3: Q4.3(SOURCE) R28.2 R53.2 U5.6(SENSE)
NetQ4_4: Q4.4(DRAIN) T2.6(+S1) T2.9(+S2)
NetR16_1: R16.1 R19.2
NetR17_1: R17.1 R20.2
NetR18_1: R18.1 R22.2 U4.9(~{SHDN}/UVLO)
NetR19_1: R19.1 R23.2
NetR20_1: R20.1 R24.2
NetR24_1: R24.1 R27.2 ; port PG_L
NetR25_2: R25.2 U4.4(RT)
NetR30_1: R30.1 R41.2
NetR31_1: R31.1 R42.2
NetR39_2: R39.2 R43.1 U5.9(~{SHDN}/UVLO)
NetR41_1: R41.1 R44.2
NetR42_1: R42.1 R46.2
NetR46_1: R46.1 R50.2 ; port PG_R
NetR48_1: R48.1 U5.4(RT)

Not connected (* = marked no-connect by the designer): T1 1(0V_1)* 2(+AUX)*; T2 1(0V_1)* 2(+AUX)*

### Notes on the sheet
- 12VDC TO 200VDC SMPS (COIL HV)
- (in symbol CMP-03913-53914267-1) +

### Library data of the parts
C12 C17 = CMP-03913-53914267-1: 860021373001 WCAP-ATG5 Aluminum Electrolytic Capacitors; Life (Hours): 2000hours; Polarity: Polar; Voltage Rating (DC): 400V; Leakage Current: 5.64µA; Tolerance: 20%; Capacitance: 470nF; Pitch: 2.5mm; Ripple Current: 14mA; Height: 11mm; Height - Seated (Max): 12.4968mm; Case/Package: Radial; REACH SVHC: Unknown; Length: 11mm; Diameter: 6.3mm; Lead Pitch: 2.4892mm; Voltage Rating: 400V; Mount: Through Hole; NexarPartId: 53914267; RoHS: Compliant; Min Operating Temperature: -25°C; Packaging: Tape & Box (TB); Max Operating Temperature: 105°C
C13 C16 C18-C21 C35 C36 C40-C43 C45 C51 = Capacitor_0603: Format: 0402; Package: 0402
D3 D4 = CMP-00278-84331306-1: S3JB Rectifier Diode, 1 Phase, 1 Element, 3A, 600V V(RRM), Silicon, DO-214AA; Manufacturer Lifecycle Status: ACTIVE; Element Configuration: Single; Max Junction Temperature (Tj): 150°C; Peak Reverse Current: 10µA; Capacitance: 40pF; Reverse Recovery Time: 1.5µs; Max Forward Surge Current (Ifsm): 80A; Mount: Surface Mount; Max Reverse Voltage (DC): 600V; RoHS: Compliant; Packaging: Cut Tape; Weight: 180mg; Schedule B: 8541100080, 8541100080; Average Rectified Current: 3A; Height: 2.65mm; Min Operating Temperature: -55°C; Reverse Voltage: 600V; Max Repetitive Reverse Voltage (Vrrm): 600V; Lifecycle Status: Production; Case/Package: SMB; Forward Current: 3A; Max Operating Temperature: 150°C; NexarPartId: 84331306
Q3 Q4 = CMP-32901-000143-1: as Q1 on sheet cd_switching; ComponentLink2URL: https://www.infineon.com/dgdl/irlr7843pbf.pdf?fileId=5546d462533600a40153566de53526d8; Temperature Range High: +175°C; Octopart: https://octopart.com/irlr7843trpbf-infineon-65875062; Temperature: -55°C to +175°C; Device Class L3: MOSFETs; Category: Trans; Package: PG-TO252-3; Footprint Url: https://www.infineon.com/cms/en/product/packages/PG-TO252/PG-TO252-3-901/; Continuous Drain Current: 161A; Digikey Description: MOSFET N-CH 30V 161A DPAK; Automotive: No; Lead Free: Yes; Drain To Source Breakdown Voltage: 30V; Height: 2.52mm; Temperature Range Low: -55°C; RoHS: TRUE; Number Of N Channels: 1; Drain To Source Voltage: 30V; ComponentLink2Description: Datasheet; Device Class L2: Transistors; Device Class L1: Discrete Semiconductors
R16-R20 R22-R27 R29-R31 R39 R41-R44 R46 R48-R51 = Resistor_0603: Format: 0402; Package: 0402
R21 R28 R52 R53 = CMP-26527-002648-1: Res Thick Film 2010 20mΩ 1% 1W ±250ppm/°C Molded SMD Plastic T/R; Resistance: 20mR; Number of Terminations: 2; Radiation Hardening: No; Series: CSRN; Length: 0.197inch; RoHS Compliant: Yes; Max Operating Temperature: 155°C; Packaging: Tape and Reel; Resistor Type: Thick Film; Tolerance: 1%; Mount: Surface Mount; Height: 0.03inch; Package Quantity: 1; Case Code (Imperial): 2010; Case Code (Metric): 5025; Max Power Dissipation: 1W; Temperature Coefficient: 250ppm/°C; Case/Package: 2010; Size Code: 2010; Width: 0.097inch; Contact Plating: Tin; Power Rating: 1W; Min Operating Temperature: -55°C; Lead Free: Lead Free
T1 T2 = 74080: Transformer; Manufacturer_Name: MYRRA; Datasheet Link: https://www.tme.com/Document/74b1c6fdfa5c80edd28be424718b4d1b/74080.pdf; Height: 18mm; Manufacturer_Part_Number: 74080
U4 U5 = CMP-09139-000585-1: IC REG CTRLR MULT TOPOLOGY 10DFN; Max Input Voltage: 100V; Number of Outputs: 1; Max Output Voltage: 12V; Max Output Current: 1.2A; Max Frequency: 1MHz; Min Input Voltage: 5.5V; Topology: Boost; Mount: Surface Mount; Min Operating Temperature: -40°C; REACH SVHC: No SVHC; Max Operating Temperature: 125°C; Output Voltage: 100V; Max Supply Voltage: 100V; Switching Frequency: 1MHz; Case/Package: DFN; Package Quantity: 121; Series: -; Packaging: Rail/Tube; RoHS Compliant: Yes; Width: 3mm; Min Supply Voltage: 5.5V; Number of Pins: 10; Length: 3mm; Height: 0.7mm

## Sheet LV_power.SchDoc
size A4; SheetNumber: 6; SheetTotal: 6
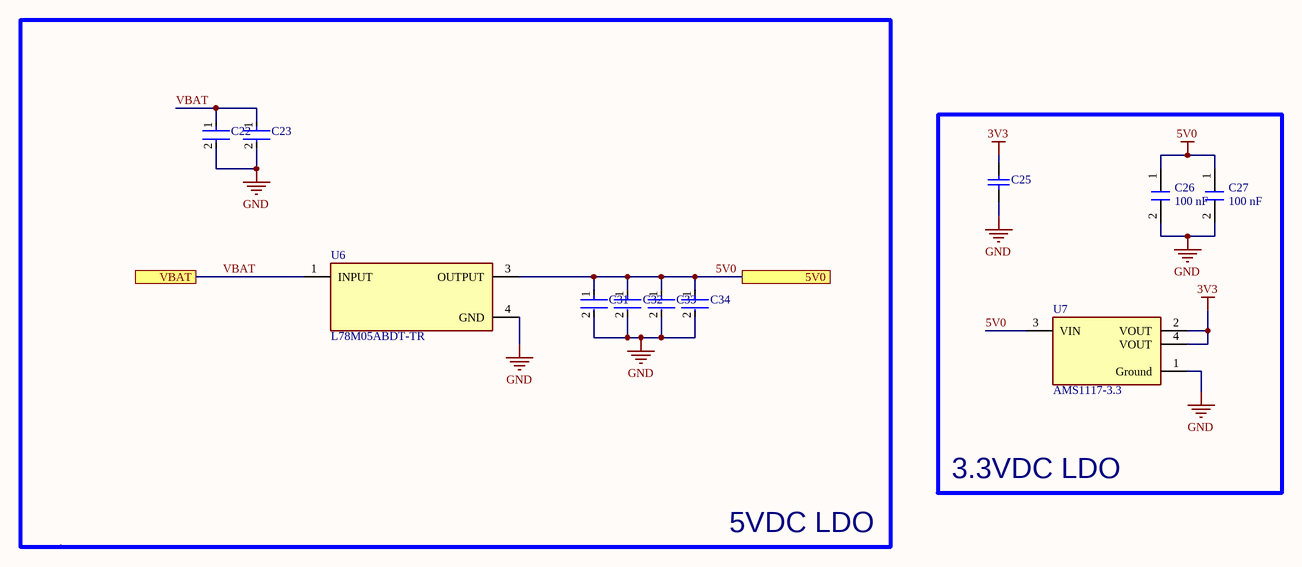
[diagram p5: LV_power.SchDoc]

### Parts
C22  CC0805MKX5R8BB226  [FP-CC0805-0_2-1_45-IPC_C]  (value not drawn)
C23  CC0805MKX5R8BB226  [FP-CC0805-0_2-1_45-IPC_C]  (value not drawn)
C25  0805ZG106ZAT2A  [CAPC2013X152X50NL20T25]  (value not drawn)
C26  value 100 nF  [0603_FP]  (hidden comment: Capacitor_0603)
C27  value 100 nF  [0603_FP]  (hidden comment: Capacitor_0603)
C31  GRM21BR61A476ME15K  [FP-GRM21B-0_2-e0_2_0_7-IPC_B]  (value not drawn)
C32  GRM21BR61A476ME15K  [FP-GRM21B-0_2-e0_2_0_7-IPC_B]  (value not drawn)
C33  GRM21BR61A476ME15K  [FP-GRM21B-0_2-e0_2_0_7-IPC_B]  (value not drawn)
C34  GRM21BR61A476ME15K  [FP-GRM21B-0_2-e0_2_0_7-IPC_B]  (value not drawn)
U6  L78M05ABDT-TR  [FP-L78M05ABDT-TR-MFG]
U7  AMS1117-3.3  [FP-AMS1117-IPC_C]

### Blocks framed on the sheet
5VDC LDO: C22 C23 C31-C34 U6
3.3VDC LDO: C25-C27 U7

### Ports
5V0 (see cd_switching[4B]), VBAT (see HV_power[1C], input_output[2D])

### Nets
3V3: C25.2 U7.2(VOUT) U7.4(VOUT)
5V0: C26.1 C27.1 C31.1 C32.1 C33.1 C34.1 U6.3(OUTPUT) U7.3(VIN) ; port 5V0
GND: C22.2 C23.2 C25.1 C26.2 C27.2 C31.2 C32.2 C33.2 C34.2 U6.4(GND) U7.1(Ground)
VBAT: C22.1 C23.1 U6.1(INPUT) ; port VBAT

### Library data of the parts
C22 C23 = CMP-03422-001497-1: CAP CER 22UF 25V X5R 0805; Tolerance: 20%; Max Operating Temperature: 85°C; Dielectric: X5R; Termination: SMD/SMT; Voltage Rating: 25V; Width: 0.049inch; Min Operating Temperature: -55°C; Case/Package: 0805; Lead Free: Lead Free; RoHS Compliant: Yes; Weight: 0.000194oz; Voltage Rating (DC): 25V; Capacitance: 22uF; Length: 0.079inch; Halogen Free: Halogen Free; Height: 1.25mm; Packaging: Tape and Reel; Package Quantity: 3000; Case Code (Metric): 2012; Thickness: 0.057inch; Case Code (Imperial): 0805; Mount: Surface Mount
C25 = CMP-2007-04523-1: Manufacturer: AVX Interconnect / Elco; Part Number: 0805ZG106ZAT2A
C26 C27 = Capacitor_0603: Format: 0402; Package: 0402
C31-C34 = CMP-06035-042633-1: Chip Multilayer Ceramic Capacitors for General Purpose, 0805, 47uF, X5R, 15%, 20%, 10V; Min Operating Temperature: -55°C; Max Operating Temperature: 85°C; Length: 0.079inch; Case Code (Imperial): 0805; Tolerance: 20%; Mount: Surface Mount; Voltage Rating (DC): 10V; Termination: SMD/SMT; Voltage Rating: 10V; Weight: 0.000335oz; Package Quantity: 10000; Dielectric: X5R; Thickness: 0.057inch; Capacitance: 47uF; Case/Package: 0805; Width: 0.049inch; Case Code (Metric): 2012; Packaging: Tape and Reel
U6 = CMP-0244-00177-2: IC REG LINEAR 5V 500MA DPAK; Polarity: Positive; Accuracy: 2%; Max Input Voltage: 35V; Tolerance: 4%; Power Supply Rejection Ratio (PSRR): 62dB; Dropout Voltage: 2V; Output Type: Fixed; Number of Regulators: 1; Min Input Voltage: 10V; Quiescent Current: 6mA; Mount: Surface Mount; Min Operating Temperature: -40°C; Lead Free: Lead Free; Number of Pins: 3; Height: 2.4mm; Weight: 0.01lb; Width: 6.2mm; Packaging: Tape and Reel; Output Current: 500mA; Output Voltage: 5V; Case/Package: TO-252; REACH SVHC: No SVHC; Max Operating Temperature: 125°C; Nominal Output Voltage: 5V; Number of Outputs: 1; Min Output Voltage: 5V; Radiation Hardening: No; Length: 6.6mm; Max Output Current: 500mA; Contact Plating: Tin; Output Voltage Accuracy: 2%; Package Quantity: 1
U7 = CMP-209535-000001-1: LDO Voltage Regulators 1A, 3.3V; Manufacturer: Advanced Monolithic Systems; Dropout Voltage: 1.1V; Output Type: Fixed; Nominal Supply Current: 5mA; Max Power Dissipation: 1.2W; Max Supply Voltage: 15V; Number Of Outputs: 1; Standoff Height: 0.64mm; Max Junction Temp: +125°C; Height: 1.8mm; Package: AMS1117; Device Class L2: Power Management ICs; ComponentLink2Description: Datasheet; ComponentLink2URL: http://www.advanced-monolithic.com/pdf/ds1117.pdf; Category: IC; RoHS: TRUE; Automotive: No; Device Class L1: Integrated Circuits (ICs); Output Current: 1A; Device Class L3: Voltage Regulators - Linear; Temperature: -40°C to +125°C; Output Voltage: 3.3V; Manufacturer Part Number: AMS1117-3.3; Temperature Range Low: -40°C; Octopart: https://octopart.com/ams1117-3.3-advanced+monolithic+systems-25899300; Lead Free: Yes; Ipc Land Pattern Name: SOT229P700X180-4; Temperature Range High: +125°C

## Nets that join several sheets
3V3: input_output (J1.3), input_signal_conditioning (7 pins), logic (17 pins), LV_power (C25.2 U7.2 U7.4)
5V0: cd_switching (C2.1 C3.2 U1.6), input_output (J4.4), LV_power (8 pins)
GND: cd_switching (6 pins), input_output (12 pins), input_signal_conditioning (10 pins), logic (19 pins), HV_power (32 pins), LV_power (11 pins)
EXT_SENSOR1_I2C_SCL: input_output (J4.2), logic (R37.2 U8.42)
EXT_SENSOR1_I2C_SDA: input_output (J4.1), logic (R38.2 U8.43)
IGNT_TRIG_L: cd_switching (U1.2), logic (U8.10)
IGNT_TRIG_R: cd_switching (U1.4), logic (U8.29)
L_COIL: cd_switching (C1.2), input_output (J6.1)
L_HV: cd_switching (C1.1 Q1.4), HV_power (5 pins)
NetC8_2: input_signal_conditioning (C8.2 R8.1 U2.1), logic (R40.1 U8.18)
NetC15_2: input_signal_conditioning (C15.2 R15.1 U2.7), logic (R47.1 U8.20)
NetD1_1: input_output (J3.4), input_signal_conditioning (D1.1)
NetD2_1: input_output (J3.3), input_signal_conditioning (D2.1)
NetJ1_12: input_output (J1.12), logic (U8.7)
NetJ4_3: input_output (J4.3), logic (R54.1)
NetJ6_2: input_output (J6.2), logic (R33.1 U8.28)
NetR24_1: logic (U8.45), HV_power (R24.1 R27.2)
NetR46_1: logic (U8.46), HV_power (R46.1 R50.2)
R_COIL: cd_switching (C4.2), input_output (J6.3)
R_HV: cd_switching (C4.1 Q2.4), HV_power (5 pins)
SWCLK: input_output (J1.6), logic (U8.37)
SWDIO: input_output (J1.4), logic (U8.34)
UART_DEBUG_RX: input_output (J1.13), logic (U8.31)
UART_DEBUG_TX: input_output (J1.14), logic (U8.30)
VBAT: input_output (6 pins), HV_power (10 pins), LV_power (C22.1 C23.1 U6.1)